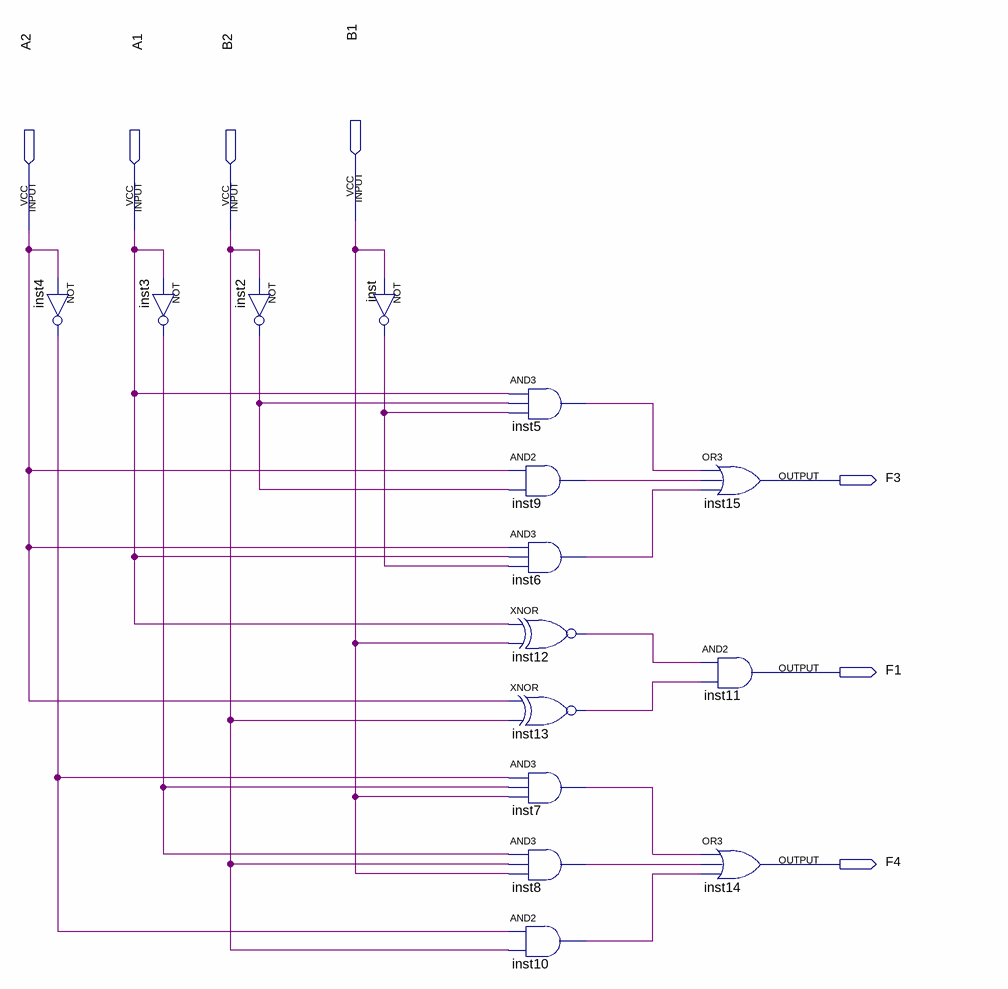
[diagram p0: schematic sheet]
// Quartus schematic twoBitComparator.bdf as structural Verilog: 15 symbols, 7 pins
module twoBitComparator (
  input  B1,
  input  A2,
  input  A1,
  input  B2,
  output F3,
  output F1,
  output F4
);

  wire inst2_out, inst3_out, inst4_out, inst5_out, inst6_out, inst7_out, inst8_out, inst9_out, inst10_out,
       inst12_out, inst13_out, inst_out;

  not inst4 (inst4_out, A2);
  not inst3 (inst3_out, A1);
  not inst2 (inst2_out, B2);
  not inst (inst_out, B1);
  and inst5 (inst5_out, A1, inst2_out, inst_out);
  and inst9 (inst9_out, A2, inst2_out);
  and inst6 (inst6_out, A2, A1, inst_out);
  xnor inst12 (inst12_out, A1, B1);
  xnor inst13 (inst13_out, A2, B2);
  and inst7 (inst7_out, inst4_out, inst3_out, B1);
  and inst8 (inst8_out, inst3_out, B2, B1);
  and inst10 (inst10_out, inst4_out, B2);
  or inst15 (F3, inst5_out, inst9_out, inst6_out);
  and inst11 (F1, inst12_out, inst13_out);
  or inst14 (F4, inst7_out, inst8_out, inst10_out);
endmodule
